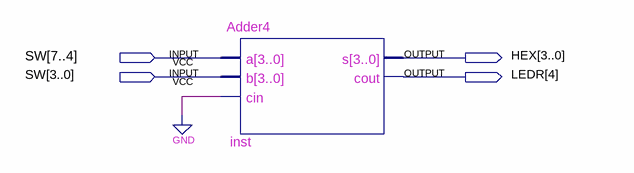
[diagram p0: schematic sheet]
// Quartus schematic AdderDemo.bdf as structural Verilog: 1 symbols, 4 pins
module AdderDemo (
  input  [7:0] SW,
  output [3:0] HEX,
  output [4:4] LEDR
);

  Adder4 inst (.a(SW[7:4]), .b(SW[3:0]), .cin(1'b0), .s(HEX), .cout(LEDR[4]));
endmodule
